# EAGLE design Scoop (EAGLE 9.1.3)

## Sheet 1 of 2

## Sheet 2 of 2
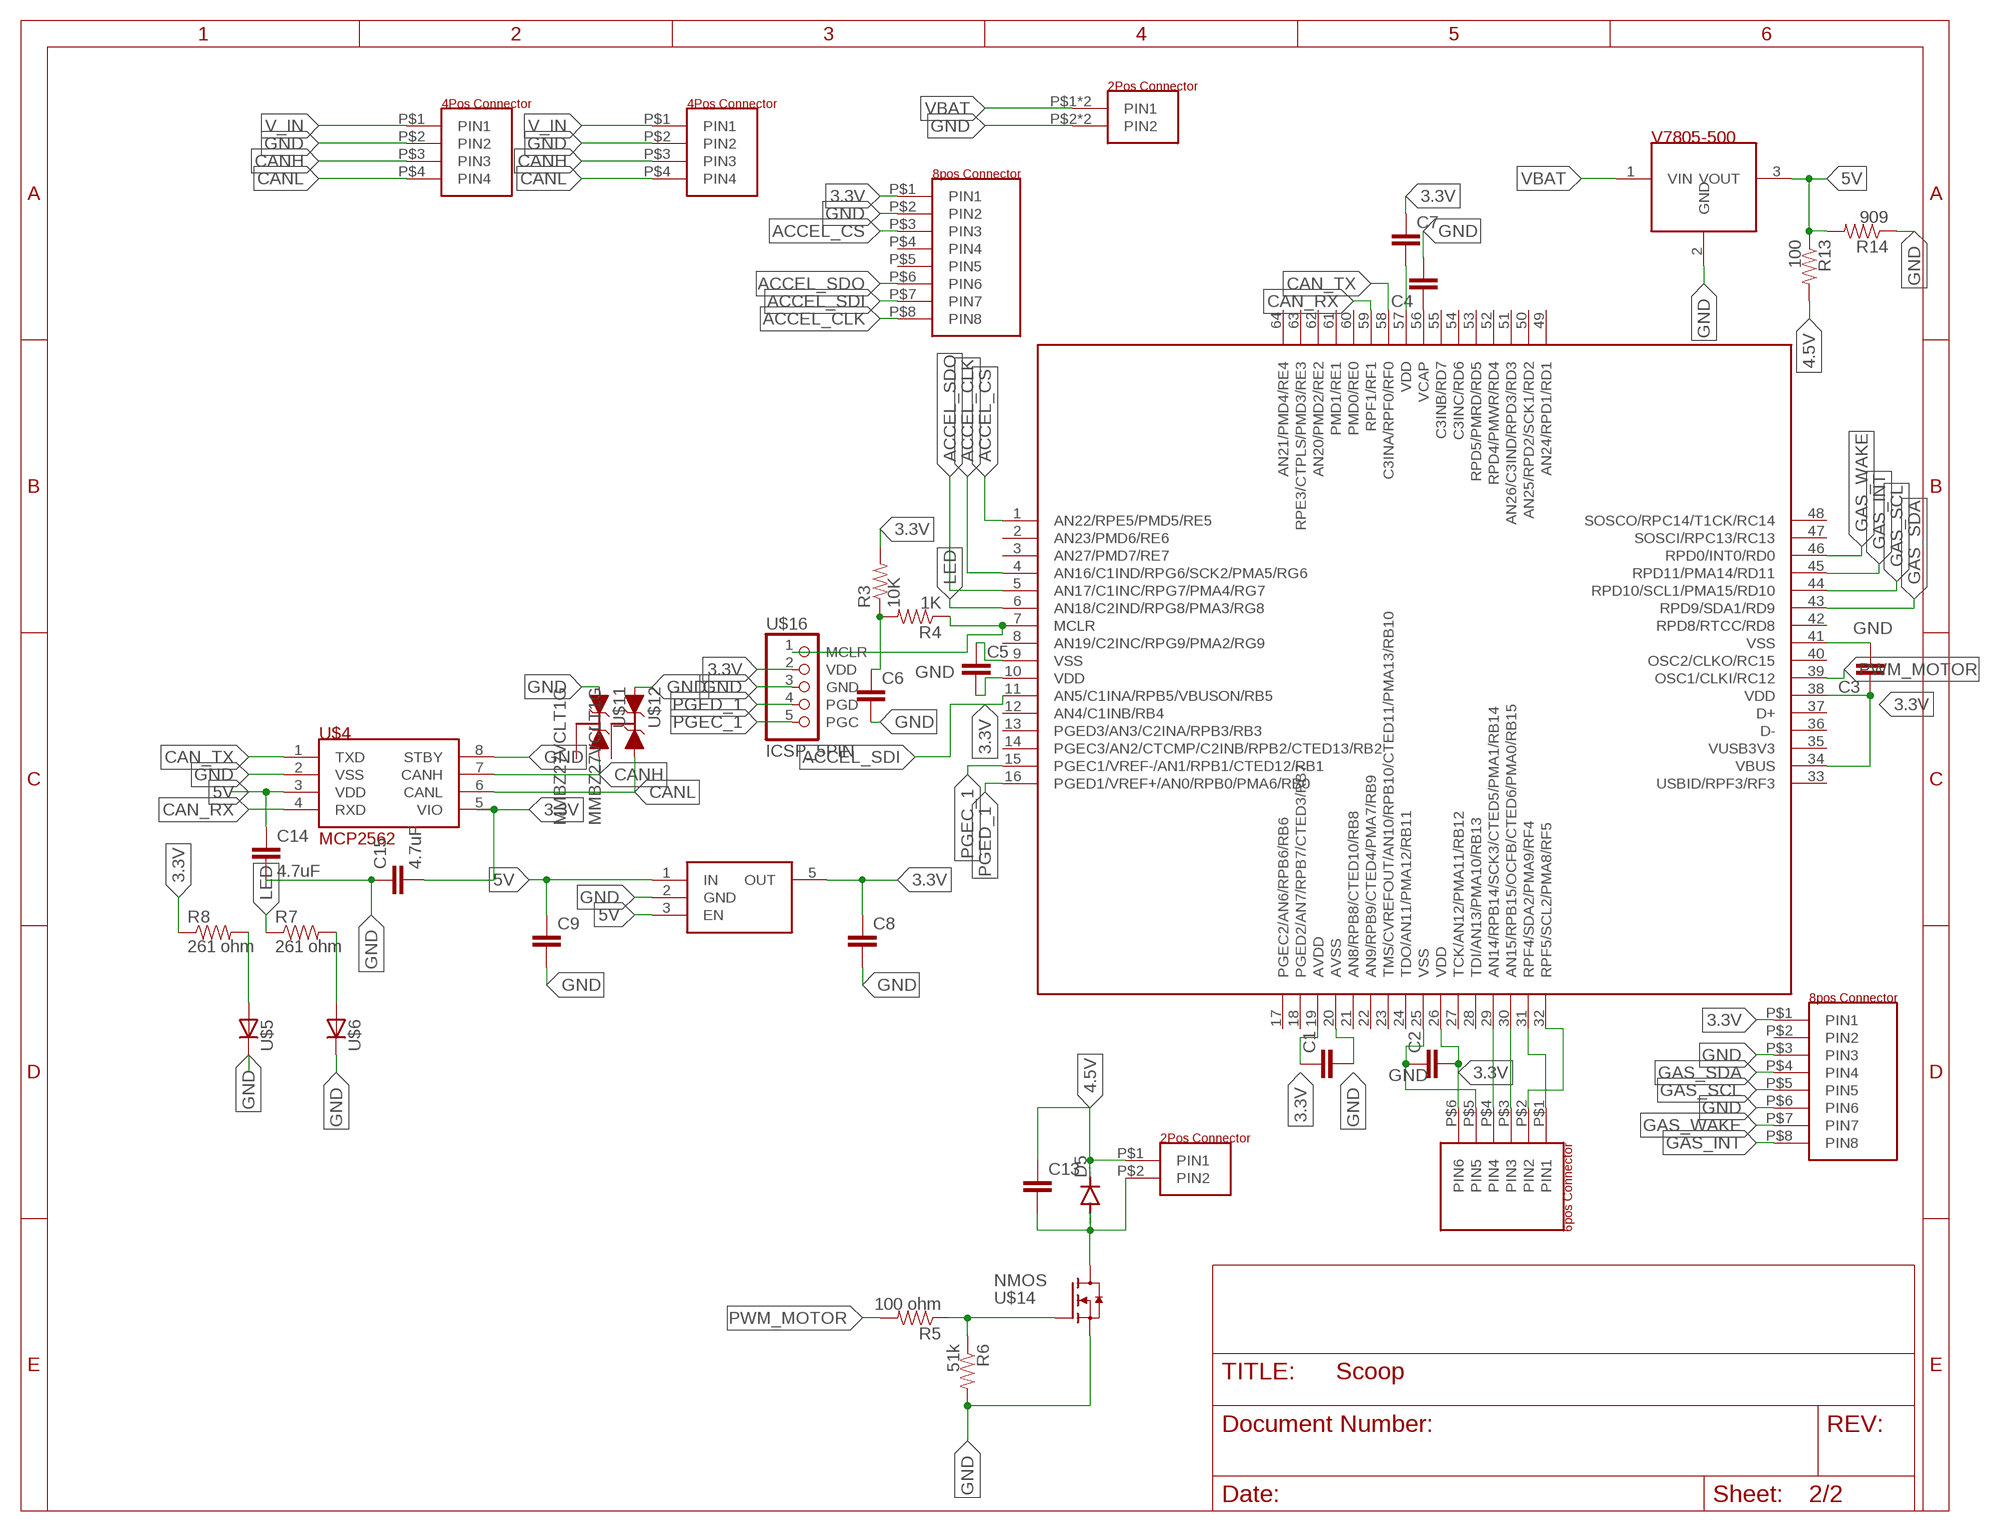
[diagram p0: schematic, sheet 2]

### Parts
C1  0.1uF  CAP-0603  [0603]
C2  0.1uF  CAP-0603  [0603]
C3  0.1uF  CAP-0603  [0603]
C4  10uF  CAP-1206  [1206]
C5  0.1uF  CAP-0603  [0603]
C6  0.1uF  CAP-0603  [0603]
C7  0.1uF  CAP-0603  [0603]
C8  1uF  CAP-0603  [0603]
C9  1uF  CAP-0603  [0603]
C13  0.1uF  CAP-0603  [0603]
C14  4.7uF  CAP-0603  [0603]
C15  4.7uF  CAP-0603  [0603]
D5  DIODE-SOD123  [SOD123]
R3  10K  1.8MOHM  [0603]
R4  1K  1.8MOHM  [0603]
R5  100 ohm  1.8MOHM  [0603]
R6  51k  1.8MOHM  [0603]
R7  261 ohm  1.8MOHM  [0603]
R8  261 ohm  1.8MOHM  [0603]
R13  100  1.8MOHM  [0603]
R14  909  1.8MOHM  [0603]
U$1  PIC32MX530F128H"  [QFP50P1200X1200X120-64]
U$2  2POS_CONNECTOR,1X2_45A_POWERPOLE  [POWERPOLE_45A_1X2]
U$4  MCP2562  [SOIC8]
U$5  LED0603  [DO0603]
U$6  LED0603  [DO0603]
U$7  2POS_CONNECTOR,.1"HEADER  [2POS_HEADER_.1"]
U$8  V7805-500  [SIP3]
U$9  TLV70233DBVR  [SOT-23-5]
U$10  8POS_CONNECTOR  [8POS_XH_TOP]
U$11  MMBZ27VCLT1G  [SOT23]
U$12  MMBZ27VCLT1G  [SOT23]
U$13  6POS_CONNECTOR.1"PITCH_HEADERS  [6POS_HEADER_.1"]
U$14  NMOS  [SOT95P237X111-3N]
U$15  8POS_CONNECTOR  [8POS_XH_TOP]
U$16  ICSP_5PIN  [ICSP_5]
U$18  4POS_CONNECTORMOLEX_MICROFIT3.0_RA_4PIN_2ROW  [MOLEX_MICROFIT3.0_0430450400]
U$19  4POS_CONNECTORMOLEX_MICROFIT3.0_RA_4PIN_2ROW  [MOLEX_MICROFIT3.0_0430450400]

### Nets
3.3V: C1.1 C2.2 C3.1 C5.2 C7.1 C8.1 C15.2 R3.2 R8.1 U$1.10(VDD) U$1.19(AVDD) U$1.26(VDD) U$1.34(VBUS) U$1.38(VDD) U$4.5(VIO) U$9.5(OUT) U$10.P$1(PIN1) U$13.P$6(PIN6) U$15.P$1(PIN1) U$16.2(VDD)
4.5V: C13.1 D5.C R13.2 U$7.P$1(PIN1)
5V: C9.1 C14.1 R13.1 R14.2 U$4.3(VDD) U$8.3(VOUT) U$9.1(IN) U$9.3(EN)
ACCEL_CLK: U$1.4(AN16/C1IND/RPG6/SCK2/PMA5/RG6) U$15.P$8(PIN8)
ACCEL_CS: U$1.1(AN22/RPE5/PMD5/RE5) U$15.P$3(PIN3)
ACCEL_SDI: U$1.11(AN5/C1INA/RPB5/VBUSON/RB5) U$15.P$7(PIN7)
ACCEL_SDO: U$1.5(AN17/C1INC/RPG7/PMA4/RG7) U$15.P$6(PIN6)
CAN_RX: U$1.59(RPF1/RF1) U$4.4(RXD)
CAN_TX: U$1.58(C3INA/RPF0/RF0) U$4.1(TXD)
CANH: U$4.7(CANH) U$11.2(A2) U$18.P$3(PIN3) U$19.P$3(PIN3)
CANL: U$4.6(CANL) U$12.2(A2) U$18.P$4(PIN4) U$19.P$4(PIN4)
GAS_INT: U$1.45(RPD11/PMA14/RD11) U$10.P$8(PIN8)
GAS_SCL: U$1.44(RPD10/SCL1/PMA15/RD10) U$10.P$5(PIN5)
GAS_SDA: U$1.43(RPD9/SDA1/RD9) U$10.P$4(PIN4)
GAS_WAKE: U$1.46(RPD0/INT0/RD0) U$10.P$7(PIN7)
GND: C1.2 C2.1 C3.2 C4.2 C5.1 C6.2 C8.2 C9.2 C14.2 C15.1 R6.2 R14.1 U$1.9(VSS) U$1.20(AVSS) U$1.25(VSS) U$1.41(VSS) U$2.P$2(PIN2) U$2.P$6(PIN2) U$4.2(VSS) U$4.8(STBY) U$5.2(C) U$6.2(C) U$8.2(GND) U$9.2(GND) U$10.P$3(PIN3) U$10.P$6(PIN6) U$11.1(A1) U$12.1(A1) U$13.P$5(PIN5) U$14.S U$15.P$2(PIN2) U$16.3(GND) U$18.P$2(PIN2) U$19.P$2(PIN2)
LED: R7.1 U$1.6(AN18/C2IND/RPG8/PMA3/RG8)
M2: C13.2 D5.A U$7.P$2(PIN2) U$14.D
N$1: U$1.31(RPF4/SDA2/PMA9/RF4) U$13.P$1(PIN1)
N$2: U$1.32(RPF5/SCL2/PMA8/RF5) U$13.P$2(PIN2)
N$3: R7.2 U$6.1(A)
N$4: C6.1 R3.1 R4.2
N$5: R5.1 R6.1 U$14.G
N$6: R8.2 U$5.1(A)
N$7: C4.1 U$1.56(VCAP)
N$8: R4.1 U$1.7(MCLR) U$16.1(MCLR)
N$9: U$1.30(AN15/RPB15/OCFB/CTED6/PMA0/RB15) U$13.P$3(PIN3)
N$10: U$1.29(AN14/RPB14/SCK3/CTED5/PMA1/RB14) U$13.P$4(PIN4)
N$28: C7.2 U$1.57(VDD)
PGEC_1: U$1.15(PGEC1/VREF-/AN1/RPB1/CTED12/RB1) U$16.5(PGC)
PGED_1: U$1.16(PGED1/VREF+/AN0/RPB0/PMA6/RB0) U$16.4(PGD)
PWM_MOTOR: R5.2 U$1.39(OSC1/CLKI/RC12)
V_IN: U$18.P$1(PIN1) U$19.P$1(PIN1)
VBAT: U$2.P$1(PIN1) U$2.P$5(PIN1) U$8.1(VIN)
Unconnected: U$1.2(AN23/PMD6/RE6) U$1.3(AN27/PMD7/RE7) U$1.8(AN19/C2INC/RPG9/PMA2/RG9) U$1.12(AN4/C1INB/RB4) U$1.13(PGED3/AN3/C2INA/RPB3/RB3) U$1.14(PGEC3/AN2/CTCMP/C2INB/RPB2/CTED13/RB2) U$1.17(PGEC2/AN6/RPB6/RB6) U$1.18(PGED2/AN7/RPB7/CTED3/RB7) U$1.21(AN8/RPB8/CTED10/RB8) U$1.22(AN9/RPB9/CTED4/PMA7/RB9) U$1.23(TMS/CVREFOUT/AN10/RPB10/CTED11/PMA13/RB10) U$1.24(TDO/AN11/PMA12/RB11) U$1.27(TCK/AN12/PMA11/RB12) U$1.28(TDI/AN13/PMA10/RB13) U$1.33(USBID/RPF3/RF3) U$1.35(VUSB3V3) U$1.36(D-) U$1.37(D+) U$1.40(OSC2/CLKO/RC15) U$1.42(RPD8/RTCC/RD8) U$1.47(SOSCI/RPC13/RC13) U$1.48(SOSCO/RPC14/T1CK/RC14) U$1.49(AN24/RPD1/RD1) U$1.50(AN25/RPD2/SCK1/RD2) U$1.51(AN26/C3IND/RPD3/RD3) U$1.52(RPD4/PMWR/RD4) U$1.53(RPD5/PMRD/RD5) U$1.54(C3INC/RD6) U$1.55(C3INB/RD7) U$1.60(PMD0/RE0) U$1.61(PMD1/RE1) U$1.62(AN20/PMD2/RE2) U$1.63(RPE3/CTPLS/PMD3/RE3) U$1.64(AN21/PMD4/RE4) U$10.P$2(PIN2) U$11.3(C) U$12.3(C) U$15.P$4(PIN4) U$15.P$5(PIN5)

## Library data of the parts
C1-C9 C13-C15 = SparkFun-Capacitors:CAP
D5 = diode:DIODE-: DIODE
R3-R8 R13 R14 = SparkFun-Resistors:1.8MOHM: 1.8 MOhms ±5% 0.1W, 1/10W Chip Resistor 0603; PROD_ID: RES-13994; VALUE: 1.8M
U$1 = CMR:PIC32MX530F128H: 32-bit Microcontrollers (up to 512 KB Flash and 64 KB SRAM) with Audio/Graphics/Touch (HMI), CAN, USB, and Advanced Analog
U$2 U$7 = CMR:2POS_CONNECTOR: Harwin 2mm 2 POS Connector Male - https://www.digikey.com/product-detail/en/harwin-inc/M80-8520242/952-1769-ND/3727738 Female - https://www.digikey.com/product-detail/en/harwin-inc/M80-8980205/952-1182-ND/2264171
U$4 = CMR:MCP2562
U$5 U$6 = CMR:LED0603: LED size 0603 for debugging pic
U$8 = CMR:V7805-500: Switching regulator (24V to 5V); max output current: 500mA
U$9 = CMR:TLV70233DBVR: TLV702 300-mA, Low-IQ, Low-Dropout Regulator
U$10 U$15 = CMR:8POS_CONNECTOR: Arbitrary 8 position connector
U$11 U$12 = CMR:MMBZ27VCLT1G: MMBZ27VCLT1G TVS Diode for protecting against ESD events link: https://www.digikey.com/product-detail/en/on-semiconductor/MMBZ27VCLT1G/MMBZ27VCLT1GOSCT-ND/964555
U$13 = CMR:6POS_CONNECTOR: An arbitray 6 position connector. packages should denote pin 1 using a square pad
U$14 = SOT95P237X111-3N:NMOS
U$16 = CMR:ICSP_5PIN
U$18 U$19 = CMR:4POS_CONNECTOR: 4 position connector could be header or connector

## Board
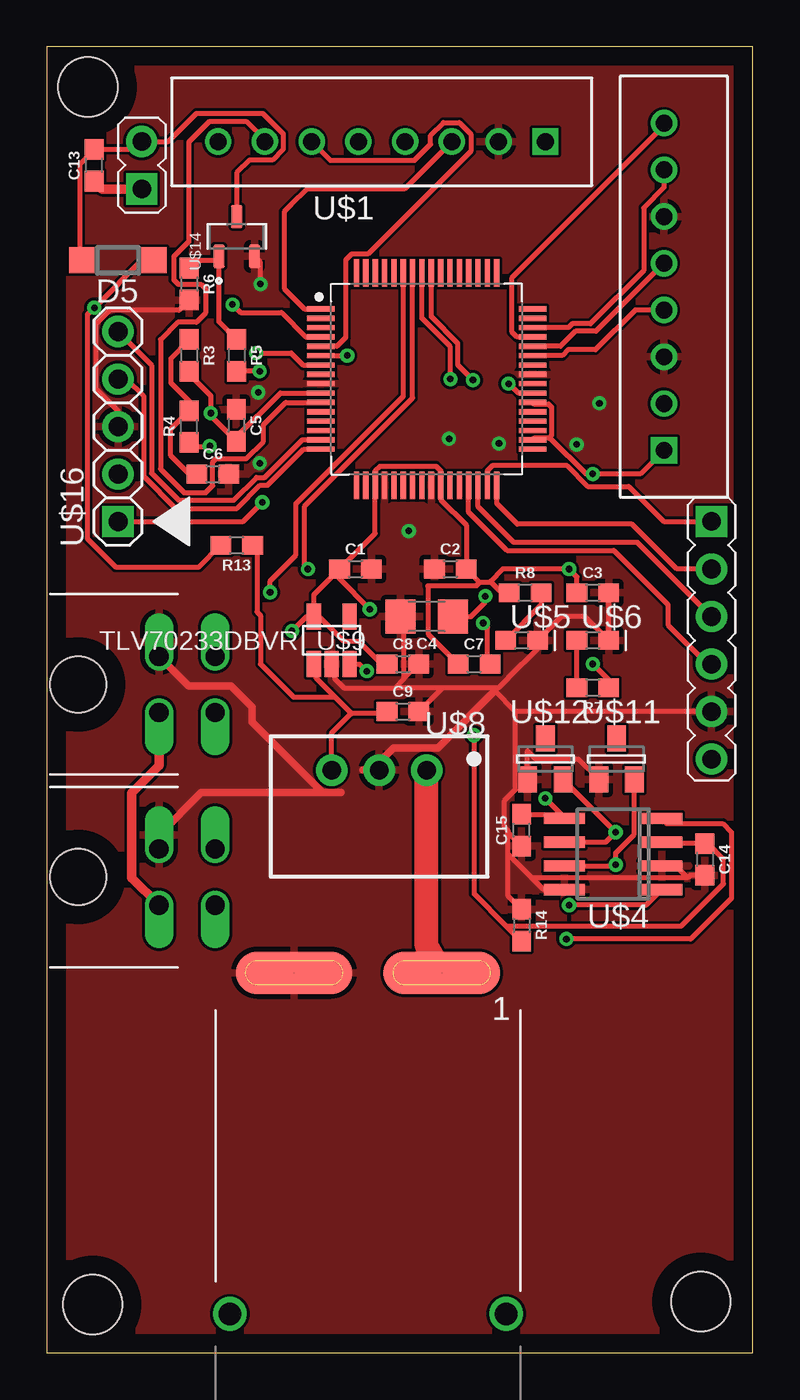
[diagram p1: board, top side]
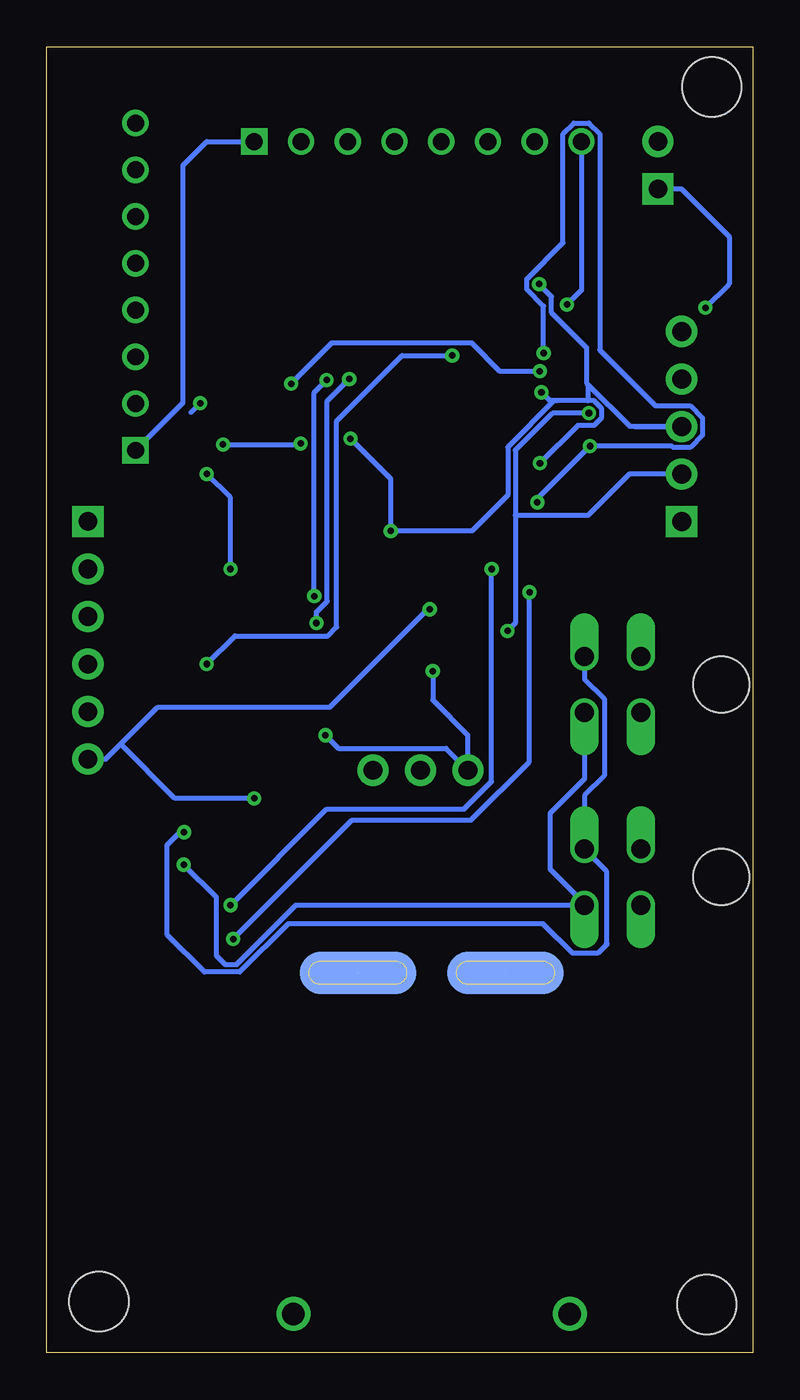
[diagram p2: board, bottom side, seen from below]

Size 37.77 x 69.84 mm. Coordinates in mm from the lower left corner, seen from the top.
Outline: 0,0 37.77,0 37.77,69.84 0,69.84 0,0
Copper layers (1*16): Top 0.035mm / dielectric 1.5mm / Bottom 0.035mm
Design rules "default *": minimum track width 6mil, minimum drill 0.35mm, track to track 6mil, track to pad 6mil, pad to pad 6mil, via to via 6mil, smd to smd 6mil, copper to edge 40mil, drill to drill 6mil, minimum pad ring 10mil, minimum via ring 8mil, stop-mask expansion 4mil, vias tented up to drill 1000mil, thermal gap 10mil
Holes 3.17 mm at 2.2,67.69 34.98,2.74 2.46,2.57

### Footprints (pad centres in the part's own frame; a part is rotated, then mirrored left to right if it is on the bottom)
0603 = smd 1.1 x 1: 1 -0.85,0; 2 0.85,0
1206 = smd 1.6 x 1.8: 1 -1.4,0; 2 1.4,0
SOD123 = smd 1.4 x 1.4: A 1.9,0; C -1.9,0
QFP50P1200X1200X120-64 = smd 1.469 x 0.28: 1 -5.671,3.75; 2 -5.671,3.25; 3 -5.671,2.75; 4 -5.671,2.25; 5 -5.671,1.75; 6 -5.671,1.25; 7 -5.671,0.75; 8 -5.671,0.25; 9 -5.671,-0.25; 10 -5.671,-0.75; 11 -5.671,-1.25; 12 -5.671,-1.75; 13 -5.671,-2.25; 14 -5.671,-2.75; 15 -5.671,-3.25; 16 -5.671,-3.75; 33 5.671,-3.75; 34 5.671,-3.25; 35 5.671,-2.75; 36 5.671,-2.25; 37 5.671,-1.75; 38 5.671,-1.25; 39 5.671,-0.75; 40 5.671,-0.25; 41 5.671,0.25; 42 5.671,0.75; 43 5.671,1.25; 44 5.671,1.75; 45 5.671,2.25; 46 5.671,2.75; 47 5.671,3.25; 48 5.671,3.75 | smd 0.28 x 1.469: 17 -3.75,-5.671; 18 -3.25,-5.671; 19 -2.75,-5.671; 20 -2.25,-5.671; 21 -1.75,-5.671; 22 -1.25,-5.671; 23 -0.75,-5.671; 24 -0.25,-5.671; 25 0.25,-5.671; 26 0.75,-5.671; 27 1.25,-5.671; 28 1.75,-5.671; 29 2.25,-5.671; 30 2.75,-5.671; 31 3.25,-5.671; 32 3.75,-5.671; 49 3.75,5.671; 50 3.25,5.671; 51 2.75,5.671; 52 2.25,5.671; 53 1.75,5.671; 54 1.25,5.671; 55 0.75,5.671; 56 0.25,5.671; 57 -0.25,5.671; 58 -0.75,5.671; 59 -1.25,5.671; 60 -1.75,5.671; 61 -2.25,5.671; 62 -2.75,5.671; 63 -3.25,5.671; 64 -3.75,5.671
POWERPOLE_45A_1X2 = smd 6.246 x 2.286: P$1 -3.95,0; P$2 3.95,0 | drill 1.2: P$3 -7.39,18.24; P$4 7.39,18.24 | smd 6.246 x 2.286 bottom: P$5 -3.95,0; P$6 3.95,0
SOIC8 = smd 0.6 x 2.2: 1 -1.905,-2.6; 2 -0.635,-2.6; 3 0.635,-2.6; 4 1.905,-2.6; 5 1.905,2.6; 6 0.635,2.6; 7 -0.635,2.6; 8 -1.905,2.6
DO0603 = smd 1.1 x 1: 1 -0.85,0; 2 0.85,0
2POS_HEADER_.1" = drill 0.991 pad 1.676 square: P$1 0,0 | drill 0.991 pad 1.676: P$2 2.54,0
SIP3 = drill 1 pad 1.676: 1 -2.54,-1.943; 2 0,-1.943; 3 2.54,-1.943
SOT-23-5 = smd 0.762 x 1.397: 1 -0.953,-1.27; 2 0,-1.27; 3 0.953,-1.27; 4 0.953,1.27; 5 -0.953,1.27
8POS_XH_TOP = drill 0.9 square: P$1 0,0 | drill 0.9: P$2 2.5,0; P$3 5,0; P$4 7.5,0; P$5 10,0; P$6 12.5,0; P$7 15,0; P$8 17.5,0
SOT23 = smd 1 x 1.4: 1 -0.95,-1.1; 2 0.95,-1.1; 3 0,1.1
6POS_HEADER_.1" = drill 0.991 pad 1.676 square: P$1 0,0 | drill 0.991 pad 1.676: P$2 2.54,0; P$3 5.08,0; P$4 7.62,0; P$5 10.16,0; P$6 12.7,0
SOT95P237X111-3N = smd 1.23 x 0.6: D 1.06,0; G -1.06,0.95; S -1.06,-0.95
ICSP_5 = drill 1.016 pad 1.676 square: 1 -5.08,0 | drill 1.016 pad 1.676: 2 -2.54,0; 3 0,0; 4 2.54,0; 5 5.08,0
MOLEX_MICROFIT3.0_0430450400 = drill 1.02 offset: P$1 1.5,4.32; P$2 -1.5,4.32; P$3 1.5,7.32; P$4 -1.5,7.32 | hole 3: 0,0

### Placement (x,y rotation side)
C1  16.51,41.91 0 top
C2  21.59,41.91 0 top
C3  29.21,40.64 0 top
C4  20.32,39.37 180 top
C5  10.14,49.59 270 top
C6  8.89,46.99 0 top
C7  22.86,36.83 0 top
C8  19.05,36.83 0 top
C9  19.05,34.29 0 top
C13  2.54,63.5 90 top
C14  35.2,26.38 270 top
C15  25.4,27.94 90 top
D5  3.81,58.42 180 top
R3  7.62,53.34 270 top
R4  7.62,49.53 90 top
R5  10.16,53.34 270 top
R6  7.62,57.15 270 top
R7  29.21,35.56 180 top
R8  25.59,40.64 0 top
R13  10.16,43.18 180 top
R14  25.4,22.86 270 top
U$1  20.32,52.07 0 top
U$2  17.18,20.32 180 top
U$4  30.29,26.67 90 top
U$5  25.4,38.1 0 top
U$6  29.21,38.1 0 top
U$7  5.08,62.23 90 top
U$8  17.78,29.21 180 top
U$9  15.24,38.1 0 top
U$10  33.02,48.26 90 top
U$11  30.48,31.75 0 top
U$12  26.67,31.75 0 top
U$13  35.56,44.45 270 top
U$14  10.16,59.69 90 top
U$15  26.67,64.77 180 top
U$16  3.81,49.53 90 top
U$18  1.68,35.74 270 top
U$19  1.68,25.44 270 top

### Tracks (layer width: path | path; a pad name or v marks a point on that pad's centre or on a via)
3.3V  (via drill 0.35)
  Top 0.152: R8.1 24.33,40.64 | 23.15,41.18 23.16,41.19 | 27.48,28.79 U$4.5 27.69,28.63
  Top 0.254: U$9.5 14.29,40.54 C1.1 | 23.78,41.19 23.16,41.19 | 24.33,40.64 23.78,41.19 | C3.1 28.36,41.49 v27.94,41.91 24.38,41.91 23.72,41.25 23.78,41.19 | U$10.P$1 31.75,46.99 29.4,46.99 | 29.4,46.99 v29.21,46.99 | C8.1 17.91,36.83 16.7,38.05 15.9,38.05 14.58,39.37 U$9.5 | C7.1 20.42,38.42 20.42,40.98 20.38,41.03 23,41.03 23.15,41.18 23.15,41.2 C2.2 22.44,44.26 21.07,45.63 U$1.26 21.09,46.42 21.09,47.15 20.83,47.41 17.81,47.41 17.57,47.17 U$1.19 17.57,43.82 C1.1 | v13.12,38.6 13.89,39.37 U$9.5 | C15.2 27.48,28.79 | 27.69,28.63 v26.67,29.65 | v17.28,39.76 v17.28,39.77 17.25,39.8 15.66,41.39 C1.1 | R3.2 7.62,52.33 8.77,51.18 v8.77,50.25 8.77,50.11 C5.2 10.14,48.95 12.5,51.32 U$1.10 | 26.89,48.95 27.01,49.06 27.01,50.58 26.84,50.74 26.07,50.74 U$1.38 | U$1.34 26.07,48.9 26.84,48.9 26.89,48.95 | 26.89,48.95 28.86,46.99 29.4,46.99
  Bottom 0.254: U$10.P$1 30.48,50.8 30.48,63.5 29.21,64.77 U$15.P$1 | v27.94,41.91 27.94,45.72 v29.21,46.99 | v8.77,50.25 10.71,50.25 12.7,48.26 12.7,44.77 | v13.12,38.6 12.7,39.02 12.7,44.77 | 12.7,44.77 8.82,44.77 6.6,46.99 U$16.2 | U$13.P$6 34.61,31.75 33.81,32.54 | 33.81,32.54 31.83,34.52 22.63,34.52 17.39,39.76 v17.28,39.76 | v26.67,29.65 30.92,29.65 33.81,32.54
4.5V  (via drill 0.35)
  Top 0.152: D5.C 5.08,58.42
  Top 0.254: 5.08,58.42 2.61,55.95 v2.54,55.88 2.18,55.52 2.18,49.66 2.18,43.53 3.68,42.03 8.16,42.03 R13.2
  Top 0.508: C13.1 2.96,62.23 U$7.P$1
  Bottom 0.254: U$7.P$1 3.81,62.23 1.27,59.69 1.27,57.15 v2.54,55.88
5V  (via drill 0.35)
  Top 0.152: R13.1 11.24,42.95
  Top 0.254: U$9.1 14.39,36.72 14.39,36.09 15.43,35.05 | 15.43,35.05 16.29,34.2 | U$9.3 16.74,36.83 v17.12,36.45 | v22.86,33.02 22.86,24.55 24.6,22.81 | R14.2 24.6,22.81 | 11.24,42.95 11.24,39.62 11.43,39.43 11.43,36.83 13.2,35.05 15.43,35.05 | 24.6,22.81 33.92,22.81 36.19,25.08 36.19,26.42 35.38,27.23 C14.1 32.97,27.23 U$4.3 | 15.43,35.05 | C9.1 18.1,34.19 16.37,34.19 16.37,34.2 16.29,34.2 | U$8.3 15.24,33.15 16.29,34.2
  Bottom 0.254: v17.12,36.45 17.12,34.9 15.24,33.02 U$8.3 16.41,32.32 22.16,32.32 v22.86,33.02
ACCEL_CLK  (via drill 0.35)
  Top 0.254: v9.94,56.05 10.37,55.62 12.55,55.62 13.85,54.32 U$1.4
  Bottom 0.254: U$15.P$8 9.17,56.82 v9.94,56.05
ACCEL_CS
  Top 0.254: U$15.P$3 19.13,62.23 13.91,62.23 13.08,61.4 12.7,61.02 12.7,56.92 13.8,55.82 U$1.1
ACCEL_SDI
  Top 0.254: U$15.P$7 11.67,64.86 10.7,65.83 8.68,65.83 7.59,64.74 7.59,59.42 6.79,58.62 6.79,57.38 7.04,57.14 8.26,57.14 8.49,56.9 8.49,55.6 8.01,55.11 7.01,55.11 6.08,54.18 6.08,47.26 7.35,46 8.51,46 8.88,46.37 8.88,47.63 9.05,47.81 10,47.81 10.66,47.81 11.59,48.74 11.59,49.63 12.78,50.82 U$1.11
ACCEL_SDO
  Top 0.254: U$15.P$6 15.17,63.77 19.68,63.77 20.53,64.62 20.53,65.1 21.22,65.79 22.07,65.79 22.69,65.17 22.69,64.26 17.18,58.76 16.31,58.76 15.99,58.43 15.99,54.29 15.52,53.82 U$1.5
CAN_RX  (via drill 0.35)
  Top 0.152: U$4.4 33.17,28.3
  Top 0.254: v27.8,22.12 v27.8,22.13 34.45,22.13 36.63,24.31 36.63,27.83 36.16,28.3 33.17,28.3 | v11.95,40.67 11.95,41.28 13.34,42.66 13.34,45.41 19.07,51.15 U$1.59
  Bottom 0.254: v27.8,22.12 21.43,28.49 15.06,28.49 11.95,31.6 11.95,40.5 v11.95,40.67
CAN_TX  (via drill 0.35)
  Top 0.254: U$4.1 32.07,23.94 v27.94,23.94 v27.94,23.93 | v13.97,41.91 13.79,42.09 13.79,45.28 19.57,51.05 U$1.58
  Bottom 0.254: v13.97,41.91 13.97,30.55 15.45,29.07 22.8,29.07 v27.94,23.93
CANH  (via drill 0.35)
  Top 0.254: v30.44,26.1 30.38,26.04 | U$11.2 31.43,27.73 30.44,26.73 v30.44,26.1 | U$4.7 30.38,26.04 | 30.38,26.04 v30.44,26.1
  Bottom 0.152: 9,24.02 U$19.P$3
  Bottom 0.254: v30.44,26.1 28.71,24.37 28.71,21.25 28.23,20.76 27.61,20.76 24.44,23.94 U$19.P$3 | U$18.P$3 9,30.69 10.85,28.84 10.85,25.87 9,24.02
CANL  (via drill 0.35)
  Top 0.254: 29.9,27.3 29.94,27.35 | 29.94,27.35 v30.43,27.84 U$12.2 | 29.9,27.3 29.94,27.35 | U$4.6 29.9,27.3
  Bottom 0.254: U$18.P$4 9,36.03 7.95,34.98 7.95,30.85 9,29.8 U$19.P$4 7.84,25.77 7.84,21.87 7.79,21.87 8.3,21.36 9.64,21.36 11.22,22.94 24.86,22.94 27.45,20.36 29.33,20.36 31.32,22.35 31.32,27.2 31.31,27.2 30.67,27.84 v30.43,27.84
GAS_INT
  Top 0.254: U$10.P$8 33.02,65.62 24.89,57.49 24.89,54.59 25.16,54.32 U$1.45
GAS_SCL
  Top 0.254: U$10.P$5 29.38,54.62 28.28,54.62 27.48,53.82 U$1.44
GAS_SDA
  Top 0.254: U$10.P$4 31.48,55.76 29.36,53.63 27.87,53.63 27.57,53.34 26.01,53.34 U$1.43
GAS_WAKE
  Top 0.254: U$10.P$7 33.02,62.32 31.93,61.23 31.93,57.87 29.09,55.03 28.12,55.03 27.91,54.82 U$1.46
GND  (via drill 0.35)  (1 unrouted)
  Top 0.152: C2.1 20.71,41.94 | C4.2 19.09,39.2 | 24.68,36.08 24.68,36.07 | 23.97,35.4 23.81,35.56 | C15.1 | U$4.2 33.66,26.04 | 11.37,47.55 v11.39,47.57 | C5.1 10.1,50.44
  Top 0.254: C8.2 19.09,36.02 | 19.09,36.02 18.63,35.56 | 19.09,39.2 19.09,36.02 | 24.68,36.08 26.25,37.65 U$5.2 27.52,39.37 28.79,39.37 U$6.2 C3.2 | 24.68,36.07 24.17,35.56 23.81,35.56 21.17,35.56 | 21.17,35.56 18.63,35.56 | U$13.P$5 25.08,34.29 | 25.08,34.29 23.97,35.4 | C9.2 21.17,35.56 | U$16.3 3.81,50.35 2.61,51.55 2.61,55.01 3.36,55.75 7.07,55.75 R6.2 | v11.43,57.15 11.43,58.31 U$14.S | U$9.2 15.4,36.67 15.4,36.05 15.89,35.56 18.63,35.56 | C15.1 24.67,27.83 | 25.08,34.29 25.08,30.12 24.49,29.53 24.49,28.11 24.67,27.93 24.67,27.83 | U$12.1 25.72,32.18 26.17,31.73 28.45,31.73 U$11.1 | R14.1 24.67,24.44 24.67,26.67 | C14.2 34.42,25.53 34.29,25.4 | 25.94,25.4 24.67,26.67 | 34.29,25.4 25.94,25.4 | 33.66,26.04 34.29,25.4 | U$4.8 26.58,24.77 25.94,25.4 | 24.67,26.67 24.67,27.83
  Top 0.406: 23.97,35.4 20.92,32.35 18.56,32.35 17.78,31.57 U$8.2 16.93,31.15 | 14.75,29.96 15.73,29.96 | U$18.P$2 7.59,35.65 9.86,35.65 10.98,34.52 10.98,33.72 14.75,29.96 | 14.75,29.96 8.27,29.96 6,27.7 U$19.P$2
  Bottom 0.254: 6.35,49.53 U$16.3 6.58,49.54 8.82,51.78 | v11.43,57.15 10.77,56.49 10.77,55.63 8.89,53.76 8.89,51.85 8.82,51.78 | 30.06,50.28 v29.56,50.78 | 9.37,49.59 v11.39,47.57 9.37,49.59 | 8.83,50.91 8.5,50.91 8.11,50.52 8.11,49.98 8.5,49.59 9.37,49.59 | 8.83,50.91 10.49,50.91 | 10.49,50.91 10.63,50.91 13.11,48.43 13.11,45.85 15.01,43.95 18.83,43.95 v19.37,43.95 19.37,46.73 v21.52,48.88 | v28.34,48.57 24.19,48.57 v24.19,48.63 | 8.82,51.78 8.82,50.92 8.83,50.91 | 10.49,50.91 10.86,50.91 v11.31,51.36
  pour Top: 0,0 0,69.85 38.1,69.85 38.1,0
LED  (via drill 0.35)
  Top 0.254: R7.1 30.06,35.98 v29.21,36.83 | v16.08,53.33 16.07,53.32 U$1.6
  Bottom 0.254: v29.21,36.83 27.71,38.33 22.73,38.33 22.26,38.8 22.26,49.83 18.76,53.33 v16.08,53.33
M2
  Top 0.254: U$14.D 10.16,63.1 10.85,63.79 12.08,63.79 12.65,64.36 12.65,65.18 11.56,66.27 8.01,66.27 6.5,64.77 U$7.P$2 4.66,64.35 C13.2 1.76,63.57 1.76,58.57 D5.A
N$1
  Top 0.254: U$13.P$1 33.02,44.45 31.14,46.33 28.94,46.33 27.84,47.43 23.83,47.43 23.55,47.15 23.55,46.42 U$1.31
N$2
  Top 0.254: U$13.P$2 33.71,41.91 31.31,44.31 25.18,44.31 24.07,45.42 U$1.32
N$3
  Top 0.254: R7.2 U$6.1
N$4
  Top 0.152: 7.62,54.14 R3.1
  Top 0.254: 7.62,54.14 6.65,53.17 6.65,51.86 7.62,50.89 R4.2 6.61,49.38 6.61,48.01 7.63,46.99 7.92,46.99 C6.1
N$5
  Top 0.152: 9.21,58.42 U$14.G
  Top 0.254: R5.1 9.21,55.14 9.21,58.42 8.04,58.42 R6.1
N$6
  Top 0.254: R8.2 26.44,39.99 U$5.1
N$7  (via drill 0.35)
  Top 0.254: C4.1 22.68,39.37 23.46,40.15 v23.46,40.46 | U$1.56 20.57,55.4 22,53.97 22,52.82 v22.8,52.02
  Bottom 0.254: v23.46,40.46 23.46,51.35 v22.8,52.02
N$8  (via drill 0.35)
  Top 0.254: R4.1 7.84,48.46 8.69,48.46 v8.72,48.48 | U$16.1 10.51,44.45 v11.53,45.48 | v11.19,53.46 13.08,53.46 13.72,52.82 U$1.7
  Bottom 0.254: v11.53,45.48 11.53,45.67 v8.72,48.48 4.35,48.48 4.27,48.41 3.35,48.41 2.69,49.07 2.69,49.99 3.35,50.65 5.21,50.65 8.19,53.62 8.19,65.18 8.76,65.75 9.58,65.75 10.15,65.18 10.15,59.36 12.09,57.42 12.09,56.88 11.19,55.98 v11.19,53.46
N$9
  Top 0.254: U$13.P$3 31.59,43.34 24.98,43.34 23.07,45.25 U$1.30
N$10
  Top 0.254: U$13.P$4 35.32,36.83 33.22,38.93 33.22,40.01 30.33,42.9 24.62,42.9 22.57,44.95 U$1.29
N$28  (via drill 0.35)
  Top 0.254: v23.34,39.02 23.58,38.78 23.58,36.96 C7.2 | v21.59,52.07 21.59,53.8 20.07,55.32 U$1.57
  Bottom 0.254: v23.34,39.02 23.34,39.61 22.77,40.19 22.77,50.89 v21.59,52.07
PGEC_1
  Top 0.254: U$16.5 5.61,52.81 5.61,47.03 7.05,45.59 10,45.59 11.22,46.8 11.65,46.8 13.67,48.82 U$1.15
PGED_1
  Top 0.254: U$16.4 4.28,52.07 5.17,51.17 5.17,46.87 6.9,45.15 10.17,45.15 11.42,46.4 11.82,46.4 13.75,48.32 U$1.16
PWM_MOTOR  (via drill 0.35)
  Top 0.254: v11.39,52.49 R5.2 | U$1.39 25.22,51.32 24.72,51.82 v24.7,51.82
  Bottom 0.152: v11.39,52.49 11.42,52.49 11.43,52.48
  Bottom 0.254: 11.43,52.48 13.52,52.48 15.04,53.99 22.52,53.99 v24.7,51.82
V_IN
  Top 0.508: U$18.P$1 6,31.4 4.55,29.95 4.55,25.39 U$19.P$1
VBAT  (1 unrouted)
  Top 1.27: U$2.P$5 20.32,21.77 U$8.1